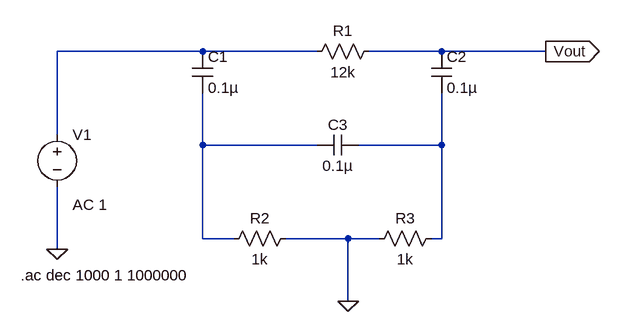
[diagram p0: schematic Passive Notch.asc]
Passive Notch.asc, the LTspice schematic file:
Version 4.1
SHEET 1 880 680
WIRE 80 16 -144 16
WIRE 256 16 80 16
WIRE 448 16 336 16
WIRE 608 16 448 16
WIRE -144 144 -144 16
WIRE 80 160 80 80
WIRE 256 160 80 160
WIRE 448 160 448 80
WIRE 448 160 320 160
WIRE 80 304 80 160
WIRE 128 304 80 304
WIRE 304 304 208 304
WIRE 352 304 304 304
WIRE 448 304 448 160
WIRE 448 304 432 304
WIRE -144 320 -144 224
WIRE 304 400 304 304
FLAG -144 320 0
FLAG 304 400 0
FLAG 608 16 Vout
IOPIN 608 16 Out
SYMBOL cap 64 16 R0
SYMATTR InstName C1
SYMATTR Value 0.1µ
SYMBOL cap 432 16 R0
SYMATTR InstName C2
SYMATTR Value 0.1µ
SYMBOL cap 320 144 R90
WINDOW 0 0 32 VBottom 2
WINDOW 3 32 32 VTop 2
SYMATTR InstName C3
SYMATTR Value 0.1µ
SYMBOL res 352 0 R90
WINDOW 0 0 56 VBottom 2
WINDOW 3 32 56 VTop 2
SYMATTR InstName R1
SYMATTR Value 12k
SYMBOL res 224 288 R90
WINDOW 0 0 56 VBottom 2
WINDOW 3 32 56 VTop 2
SYMATTR InstName R2
SYMATTR Value 1k
SYMBOL res 448 288 R90
WINDOW 0 0 56 VBottom 2
WINDOW 3 32 56 VTop 2
SYMATTR InstName R3
SYMATTR Value 1k
SYMBOL voltage -144 128 R0
WINDOW 123 24 124 Left 2
WINDOW 39 0 0 Left 0
WINDOW 3 24 44 Left 2
SYMATTR Value2 AC 1
SYMATTR Value ""
SYMATTR InstName V1
TEXT -200 360 Left 2 !.ac dec 1000 1 1000000

The netlist it stands for:
* Passive Notch.asc
C1 N001 N002 0.1µ
C2 Vout N003 0.1µ
C3 N003 N002 0.1µ
R1 Vout N001 12k
R2 0 N002 1k
R3 N003 0 1k
V1 N001 0 AC 1
.ac dec 1000 1 1000000
.backanno
.end